# EAGLE design rgb_and_irdistance_side3 (EAGLE 6.5.0)
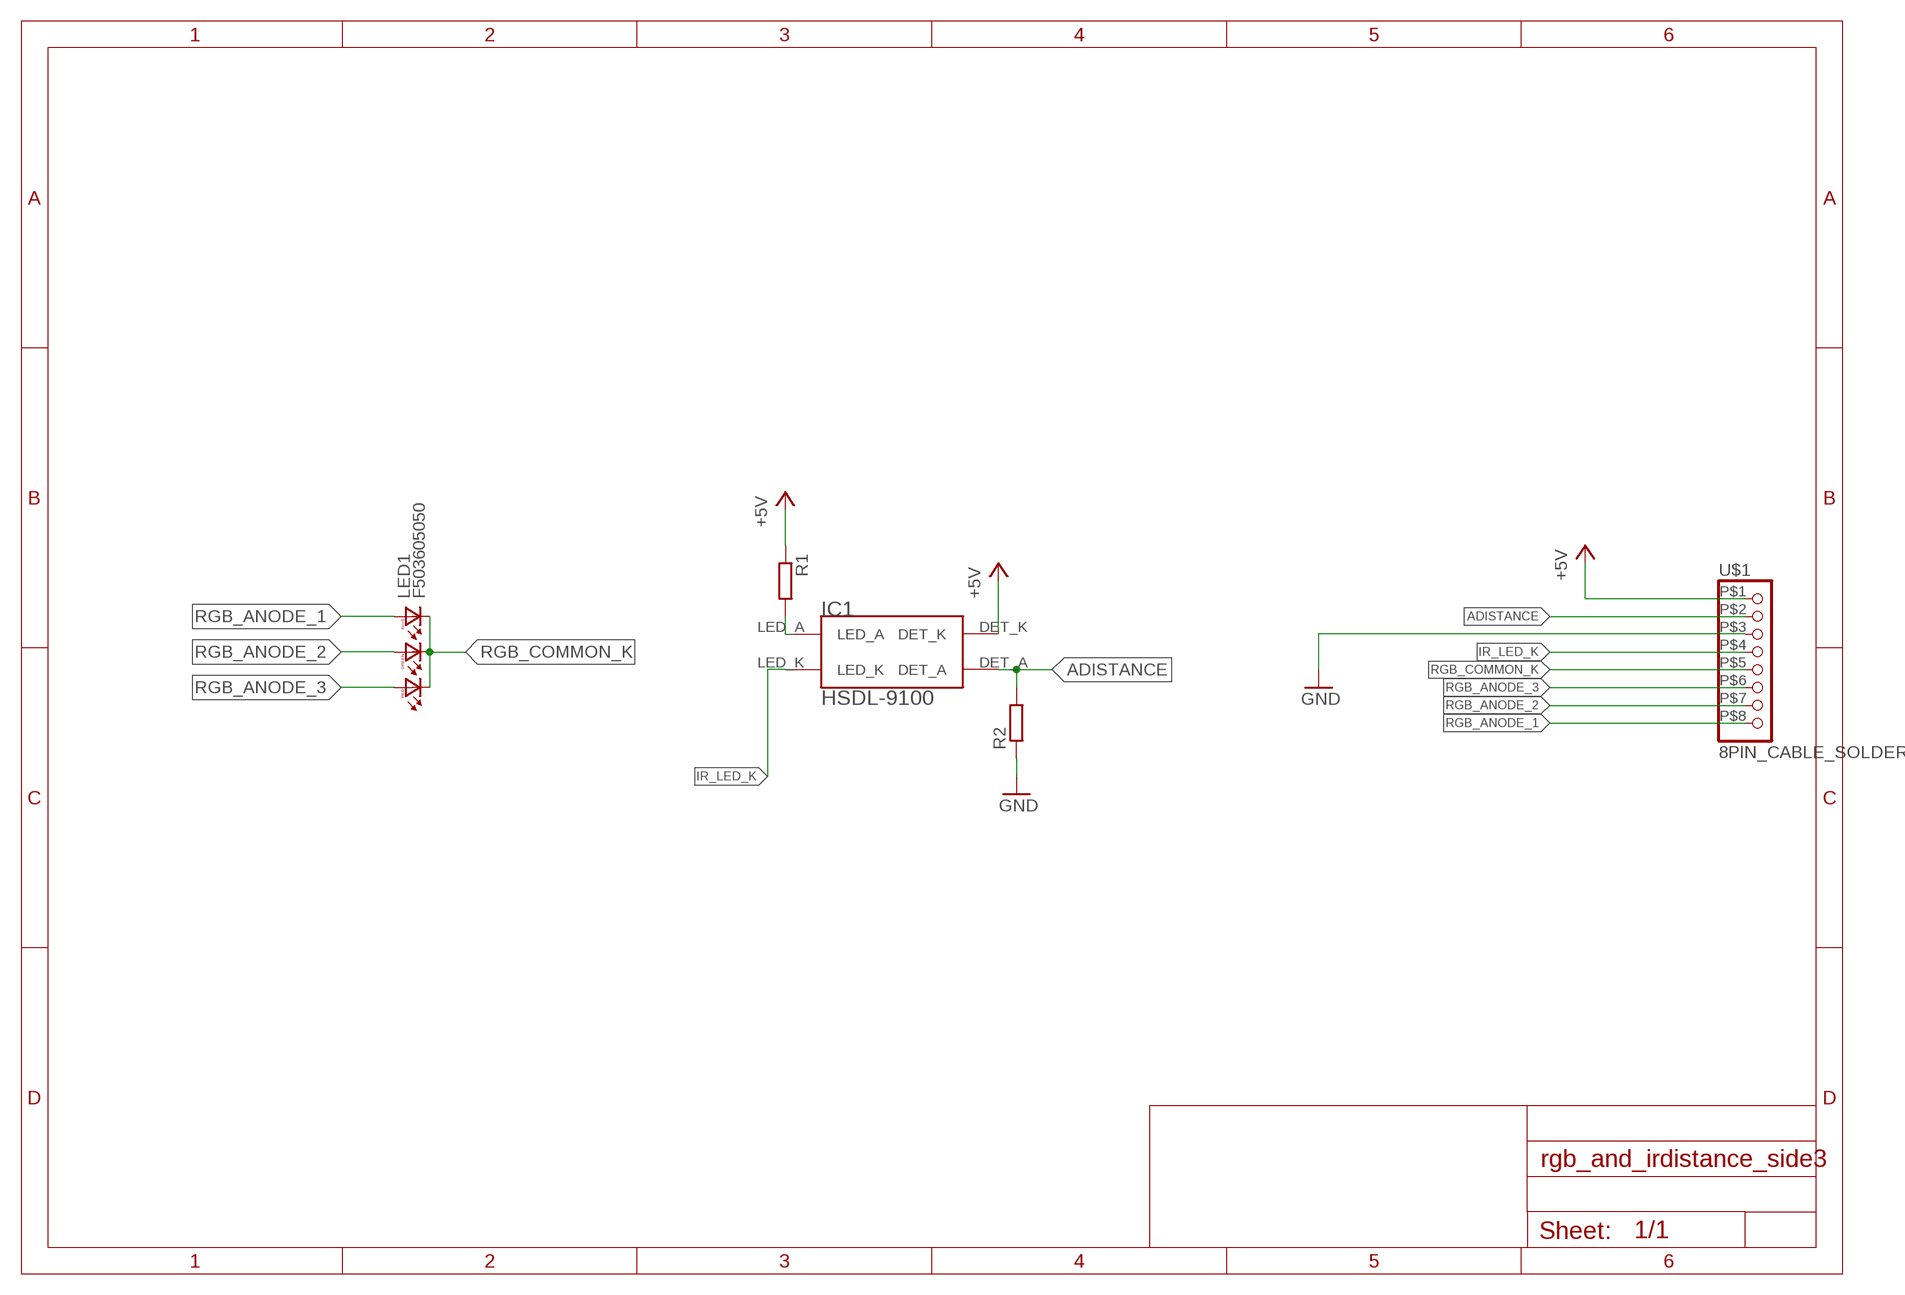
[diagram p0: schematic, sheet 1]

## Parts
IC1  HSDL-9100  [HSDL-9100]
LED1  F503605050  [5050LED]
R1  R-EU_M0805  [M0805]
R2  R-EU_M0805  [M0805]
U$1  8PIN_CABLE_SOLDER  [8PIN_CABLE_SOLDER]

## Nets
+5V: IC1.DET_K R1.1 U$1.P$1
ADISTANCE: IC1.DET_A R2.2 U$1.P$2
GND: R2.1 U$1.P$3
IR_LED_K: IC1.LED_K U$1.P$4
N$2: IC1.LED_A R1.2
RGB_ANODE_1: LED1.B1(BA) U$1.P$8
RGB_ANODE_2: LED1.G1(GA) U$1.P$7
RGB_ANODE_3: LED1.R1(RA) U$1.P$6
RGB_COMMON_K: LED1.B2(BC) LED1.G2(GC) LED1.R2(RC) U$1.P$5

## Library data of the parts
IC1 = BEEP:HSDL-9100
LED1 = BEEP:F50360: Full color Z-Power LED RGB P5-II Series Source: http://www.seoulsemicon.co.kr .. F50360.pdf
R1 R2 = resistor:R-EU_: RESISTOR, European symbol
U$1 = BEEP:8PIN_CABLE_SOLDER

## Board
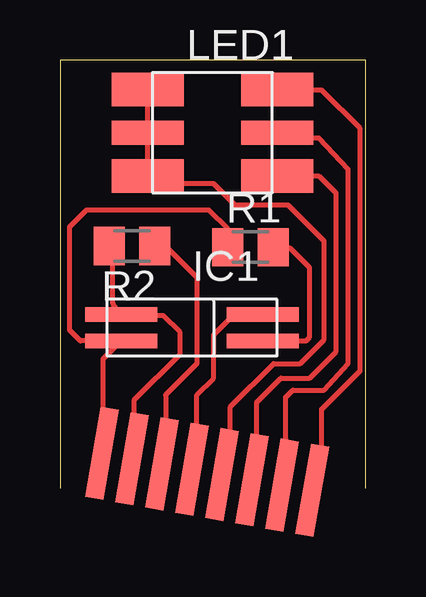
[diagram p1: board, top side]

Size 12.73 x 17.85 mm. Coordinates in mm from the lower left corner, seen from the top.
Outline: 12.73,0 12.73,17.85 0,17.85 0,0
Copper layers (1*16): Top 0.035mm / dielectric 1.5mm / Bottom 0.035mm
Design rules "default *": minimum track width 8mil, minimum drill 24mil, track to track 8mil, track to pad 8mil, pad to pad 8mil, via to via 8mil, smd to smd 8mil, copper to edge 0mil, drill to drill 8mil, minimum pad ring 10mil, minimum via ring 8mil, stop-mask expansion 4mil, vias tented up to drill 0mil, thermal gap 10mil

### Footprints (pad centres in the part's own frame; a part is rotated, then mirrored left to right if it is on the bottom)
HSDL-9100 = smd 3 x 0.6: DET_A 2.95,-0.55; DET_K 2.95,0.55; LED_A -2.95,0.55; LED_K -2.95,-0.55
5050LED = smd 3 x 1.4: B1 -2.7,-1.8; B2 2.7,-1.8; R1 -2.7,1.8; R2 2.7,1.8 | smd 3 x 1: G1 -2.7,0; G2 2.7,0
M0805 = smd 1.3 x 1.6: 1 -0.95,0; 2 0.95,0
8PIN_CABLE_SOLDER = smd 0.762 x 3.81: P$1 -3.81,0; P$2 -2.54,0; P$3 -1.27,0; P$4 0,0; P$5 1.27,0; P$6 2.54,0; P$7 3.81,0; P$8 5.08,0

### Placement (x,y rotation side)
IC1  5.5,6.7 180 top
LED1  6.35,14.82 180 top
R1  7.94,10.05 0 top
R2  3,10.1 180 top
U$1  5.5,0.8 350 top

### Tracks (layer width: path | path; a pad name or v marks a point on that pad's centre or on a via)
+5V
  Top 0.203: U$1.P$1 1.85,1.55 1.8,2 1.8,5.4 IC1.DET_K 0.85,6.15 0.4,6.6 0.4,10.9 1.1,11.6 6.2,11.6 6.99,10.81 R1.1
ADISTANCE
  Top 0.203: U$1.P$2 3.2,1.9 3.1,2.3 3.1,3.7 5,5.6 5,6.5 4.3,7.2 3.2,7.2 IC1.DET_A 2.2,7.7 2.2,10.05 R2.2
GND
  Top 0.203: R2.1 4.4,10.1 5.7,8.8 5.7,5.2 4.4,3.9 4.4,2.5 4.5,2.4 4.5,0.93 U$1.P$3
IR_LED_K
  Top 0.203: IC1.LED_K 9,7.3 7.3,7.3 6.4,6.4 6.4,4.6 5.7,3.9 5.7,2.6 6,2.3 U$1.P$4
N$2
  Top 0.203: IC1.LED_A 10.25,6.15 10.4,6.3 10.4,9.2 9.6,10 8.94,10 R1.2
RGB_ANODE_1
  Top 0.203: LED1.B1 9.07,16.6 10.9,16.6 12.5,15 12.5,4.9 10.9,3.3 10.9,1.7 10.5,1.3 U$1.P$8
RGB_ANODE_2
  Top 0.203: U$1.P$7 9.75,1.65 9.4,2 9.4,3.8 9.7,4.1 11,4.1 12,5.2 12,13.3 10.8,14.6 9.27,14.6 LED1.G1
RGB_ANODE_3
  Top 0.203: U$1.P$6 8.5,1.6 8.2,1.9 8.2,3.6 9.2,4.6 10.4,4.6 11.5,5.7 11.5,12.3 10.8,13 9.07,13 LED1.R1
RGB_COMMON_K
  Top 0.203: U$1.P$5 7.05,2.25 7.1,2.4 7.1,3.4 8.9,5.2 10,5.2 11,6.2 11,10.3 9.5,11.8 7.3,11.8 6.4,12.7 3.97,12.7 LED1.R2 LED1.G2 LED1.B2